# EAGLE schematic main-board (EAGLE 9.6.2)
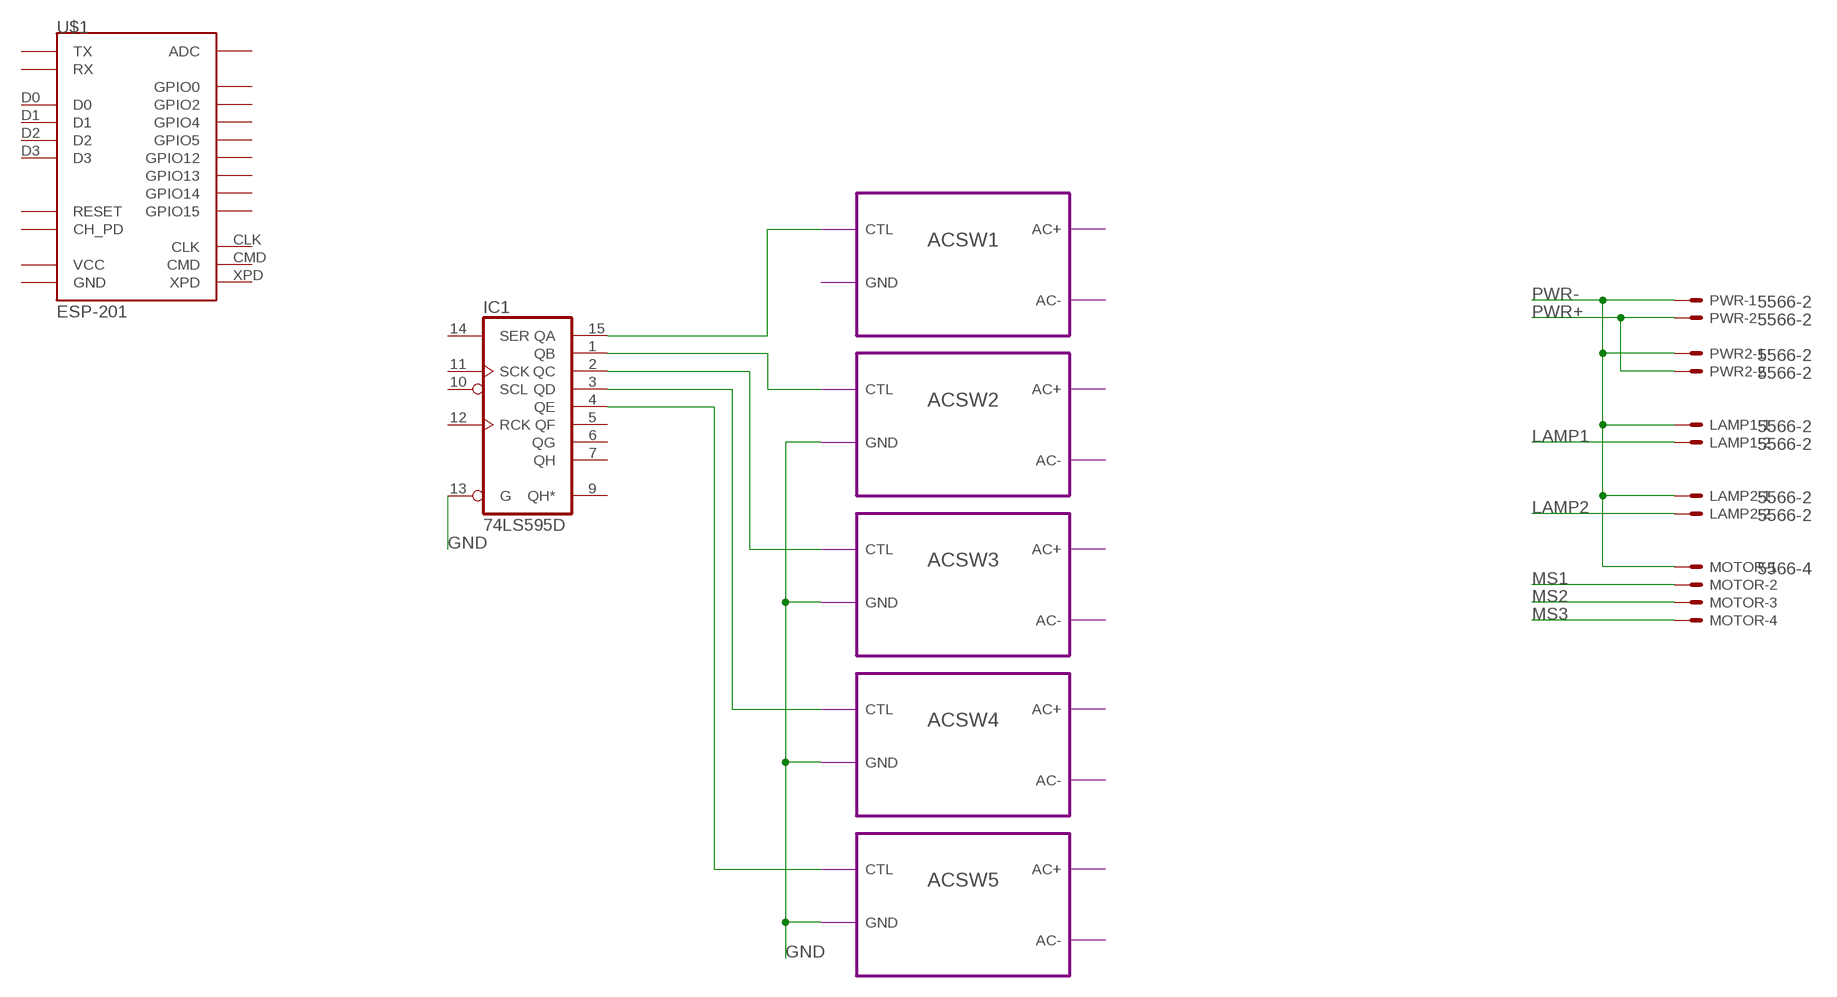
[diagram p0: schematic, sheet 1]

## Parts
IC1  74LS595D  [SO16]
LAMP1  5566-2  [5566-2]
LAMP2  5566-2  [5566-2]
MOTOR  5566-4  [5566-4]
PWR  5566-2  [5566-2]
PWR2  5566-2  [5566-2]
U$1  ESP-201  [ESP-201]

## Module instances
ACSW1 = AC_SW$A
ACSW2 = AC_SW$A
ACSW3 = AC_SW$A
ACSW4 = AC_SW$A
ACSW5 = AC_SW$A

## Nets
GND: IC1.13(G) ; port ACSW2.GND ACSW5.GND ACSW4.GND ACSW3.GND
LAMP1: LAMP1.2
LAMP2: LAMP2.2
MS1: MOTOR.2
MS2: MOTOR.3
MS3: MOTOR.4
N$1: IC1.15(QA) ; port ACSW1.CTL
N$2: IC1.1(QB) ; port ACSW2.CTL
N$3: IC1.2(QC) ; port ACSW3.CTL
N$4: IC1.3(QD) ; port ACSW4.CTL
N$5: IC1.4(QE) ; port ACSW5.CTL
PWR+ [AC]: PWR2.2 PWR.2
PWR- [AC]: LAMP1.1 LAMP2.1 MOTOR.1 PWR2.1 PWR.1
Unconnected: IC1.5(QF) IC1.6(QG) IC1.7(QH) IC1.9(QH*) IC1.10(SCL) IC1.11(SCK) IC1.12(RCK) IC1.14(SER) U$1.3V3(VCC) U$1.3V3_2(VCC) U$1.3V3_3(VCC) U$1.ADC U$1.CH_PD U$1.CLK U$1.CMD U$1.D0 U$1.D1 U$1.D2 U$1.D3 U$1.GND U$1.GND_2(GND) U$1.GND_3(GND) U$1.GPIO0 U$1.GPIO2 U$1.GPIO4 U$1.GPIO5 U$1.GPIO12 U$1.GPIO13 U$1.GPIO14 U$1.GPIO15 U$1.RST(RESET) U$1.RX U$1.TX U$1.XPD

## Power pins joined to a net without a drawn wire
GND: IC1.8(GND)
VCC: IC1.16(VCC)

## Library data of the parts
IC1 = 74xx-us:74*595: 8-bit SHIFT REGISTER, output latch
LAMP1 LAMP2 PWR PWR2 = omez-packs:5566-2: Mini FIT connector 2 pol Source: http://www.molex.com; MF: MOLEX; OC_FARNELL: 1822072; OC_NEWARK: unknown
MOTOR = omez-packs:5566-4: Mini FIT connector 4 pol Source: http://www.molex.com; MF: MOLEX; OC_FARNELL: unknown; OC_NEWARK: unknown
U$1 = esp8266modules:ESP-201: ESP8266 Wifi Module ESP-201; DIMENSIONS: 25 x 35 mm; PINS: 26; PITCH: 0.1" / 2.54 mm

## Module AC_SW
Ports: AC-(in) AC+(in) CTL(in) GND(in)
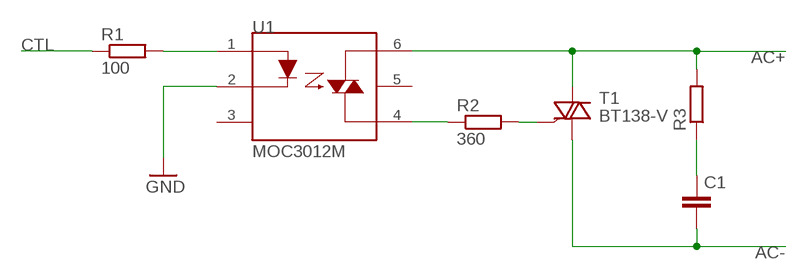
[diagram p1: schematic, module AC_SW, sheet 1]

### Parts
C1  C-EU050-030X075  [C050-030X075]
R1  100  R-EU_R1206  [R1206]
R2  360  R-EU_R1206  [R1206]
R3  R-EU_0204/7  [0204/7]
T1  BT138-V  [TO220BV]
U1  MOC3012M  [MOC3012M]

### Nets
AC+: R3.2 T1.T2(A2) U1.6(MT2)
AC-: C1.2 T1.T1(A1)
CTL: R1.1
GND: U1.2(CATHODE)
N$1: R1.2 U1.1(ANODE)
N$2: R2.1 U1.4(MT1)
N$5: R2.2 T1.G
N$8: C1.1 R3.1
Unconnected: U1.3(NC) U1.5(NC1)

### Library data of the parts
C1 = resistor:C-EU: CAPACITOR, European symbol
R1 R2 = resistor:R-EU_: RESISTOR, European symbol
R3 = resistor:R-EU_: RESISTOR, European symbol; SPICEPREFIX: R
T1 = triac:BT138: TRIAC Source: http://www.semiconductors.philips.com BT138_SERIES_2.pdf
U1 = IC:MOC3012M: OPTOISOLATOR 4.17KV TRIAC 6DIP Manufacturer's datasheet <https://www.onsemi.com/pub/Collateral/MOC3023M-D.PDF>; CREATED_BY: PCBLayout.com; DIGIKEY_PARTNO: MOC3012M-ND; MANUFACTURER: ON Semiconductor; MPN: MOC3012M; PACKAGE: DIP-06

## Module AC_SW$A
Ports: CTL(io) GND(io) AC+(io) AC-(io)
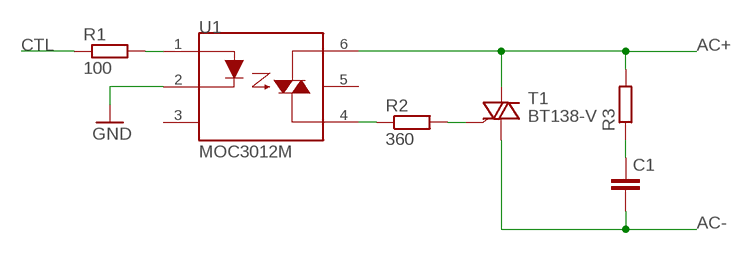
[diagram p2: schematic, module AC_SW$A, sheet 1]

### Parts
C1  C-EU050-030X075  [C050-030X075]
R1  100  R-EU_R1206  [R1206]
R2  360  R-EU_R1206  [R1206]
R3  R-EU_0204/7  [0204/7]
T1  BT138-V  [TO220BV]
U1  MOC3012M  [MOC3012M]

### Nets
AC+: R3.2 T1.T2(A2) U1.6(MT2)
AC-: C1.2 T1.T1(A1)
CTL: R1.1
GND: U1.2(CATHODE)
N$1: R1.2 U1.1(ANODE)
N$2: R2.1 U1.4(MT1)
N$5: R2.2 T1.G
N$8: C1.1 R3.1
Unconnected: U1.3(NC) U1.5(NC1)

### Library data of the parts
C1 = resistor:C-EU: CAPACITOR, European symbol
R1 R2 = resistor:R-EU_: RESISTOR, European symbol
R3 = resistor:R-EU_: RESISTOR, European symbol; SPICEPREFIX: R
T1 = triac:BT138: TRIAC Source: http://www.semiconductors.philips.com BT138_SERIES_2.pdf
U1 = IC:MOC3012M: OPTOISOLATOR 4.17KV TRIAC 6DIP Manufacturer's datasheet <https://www.onsemi.com/pub/Collateral/MOC3023M-D.PDF>; CREATED_BY: PCBLayout.com; DIGIKEY_PARTNO: MOC3012M-ND; MANUFACTURER: ON Semiconductor; MPN: MOC3012M; PACKAGE: DIP-06

## Net classes
1 AC: width 2.032 mm